# EasyEDA Pro project 降压散热拓展版.eprj

# Schematic Schematic1
Board Name: Board1; Create Date: 2025-02-11; Page Name: P1; Project Name: 降压散热拓展版; Schematic Name: Schematic1; Update Date: 2025-02-11; Company: 嘉立创EDA; Page Size: A4; Version: V1.0
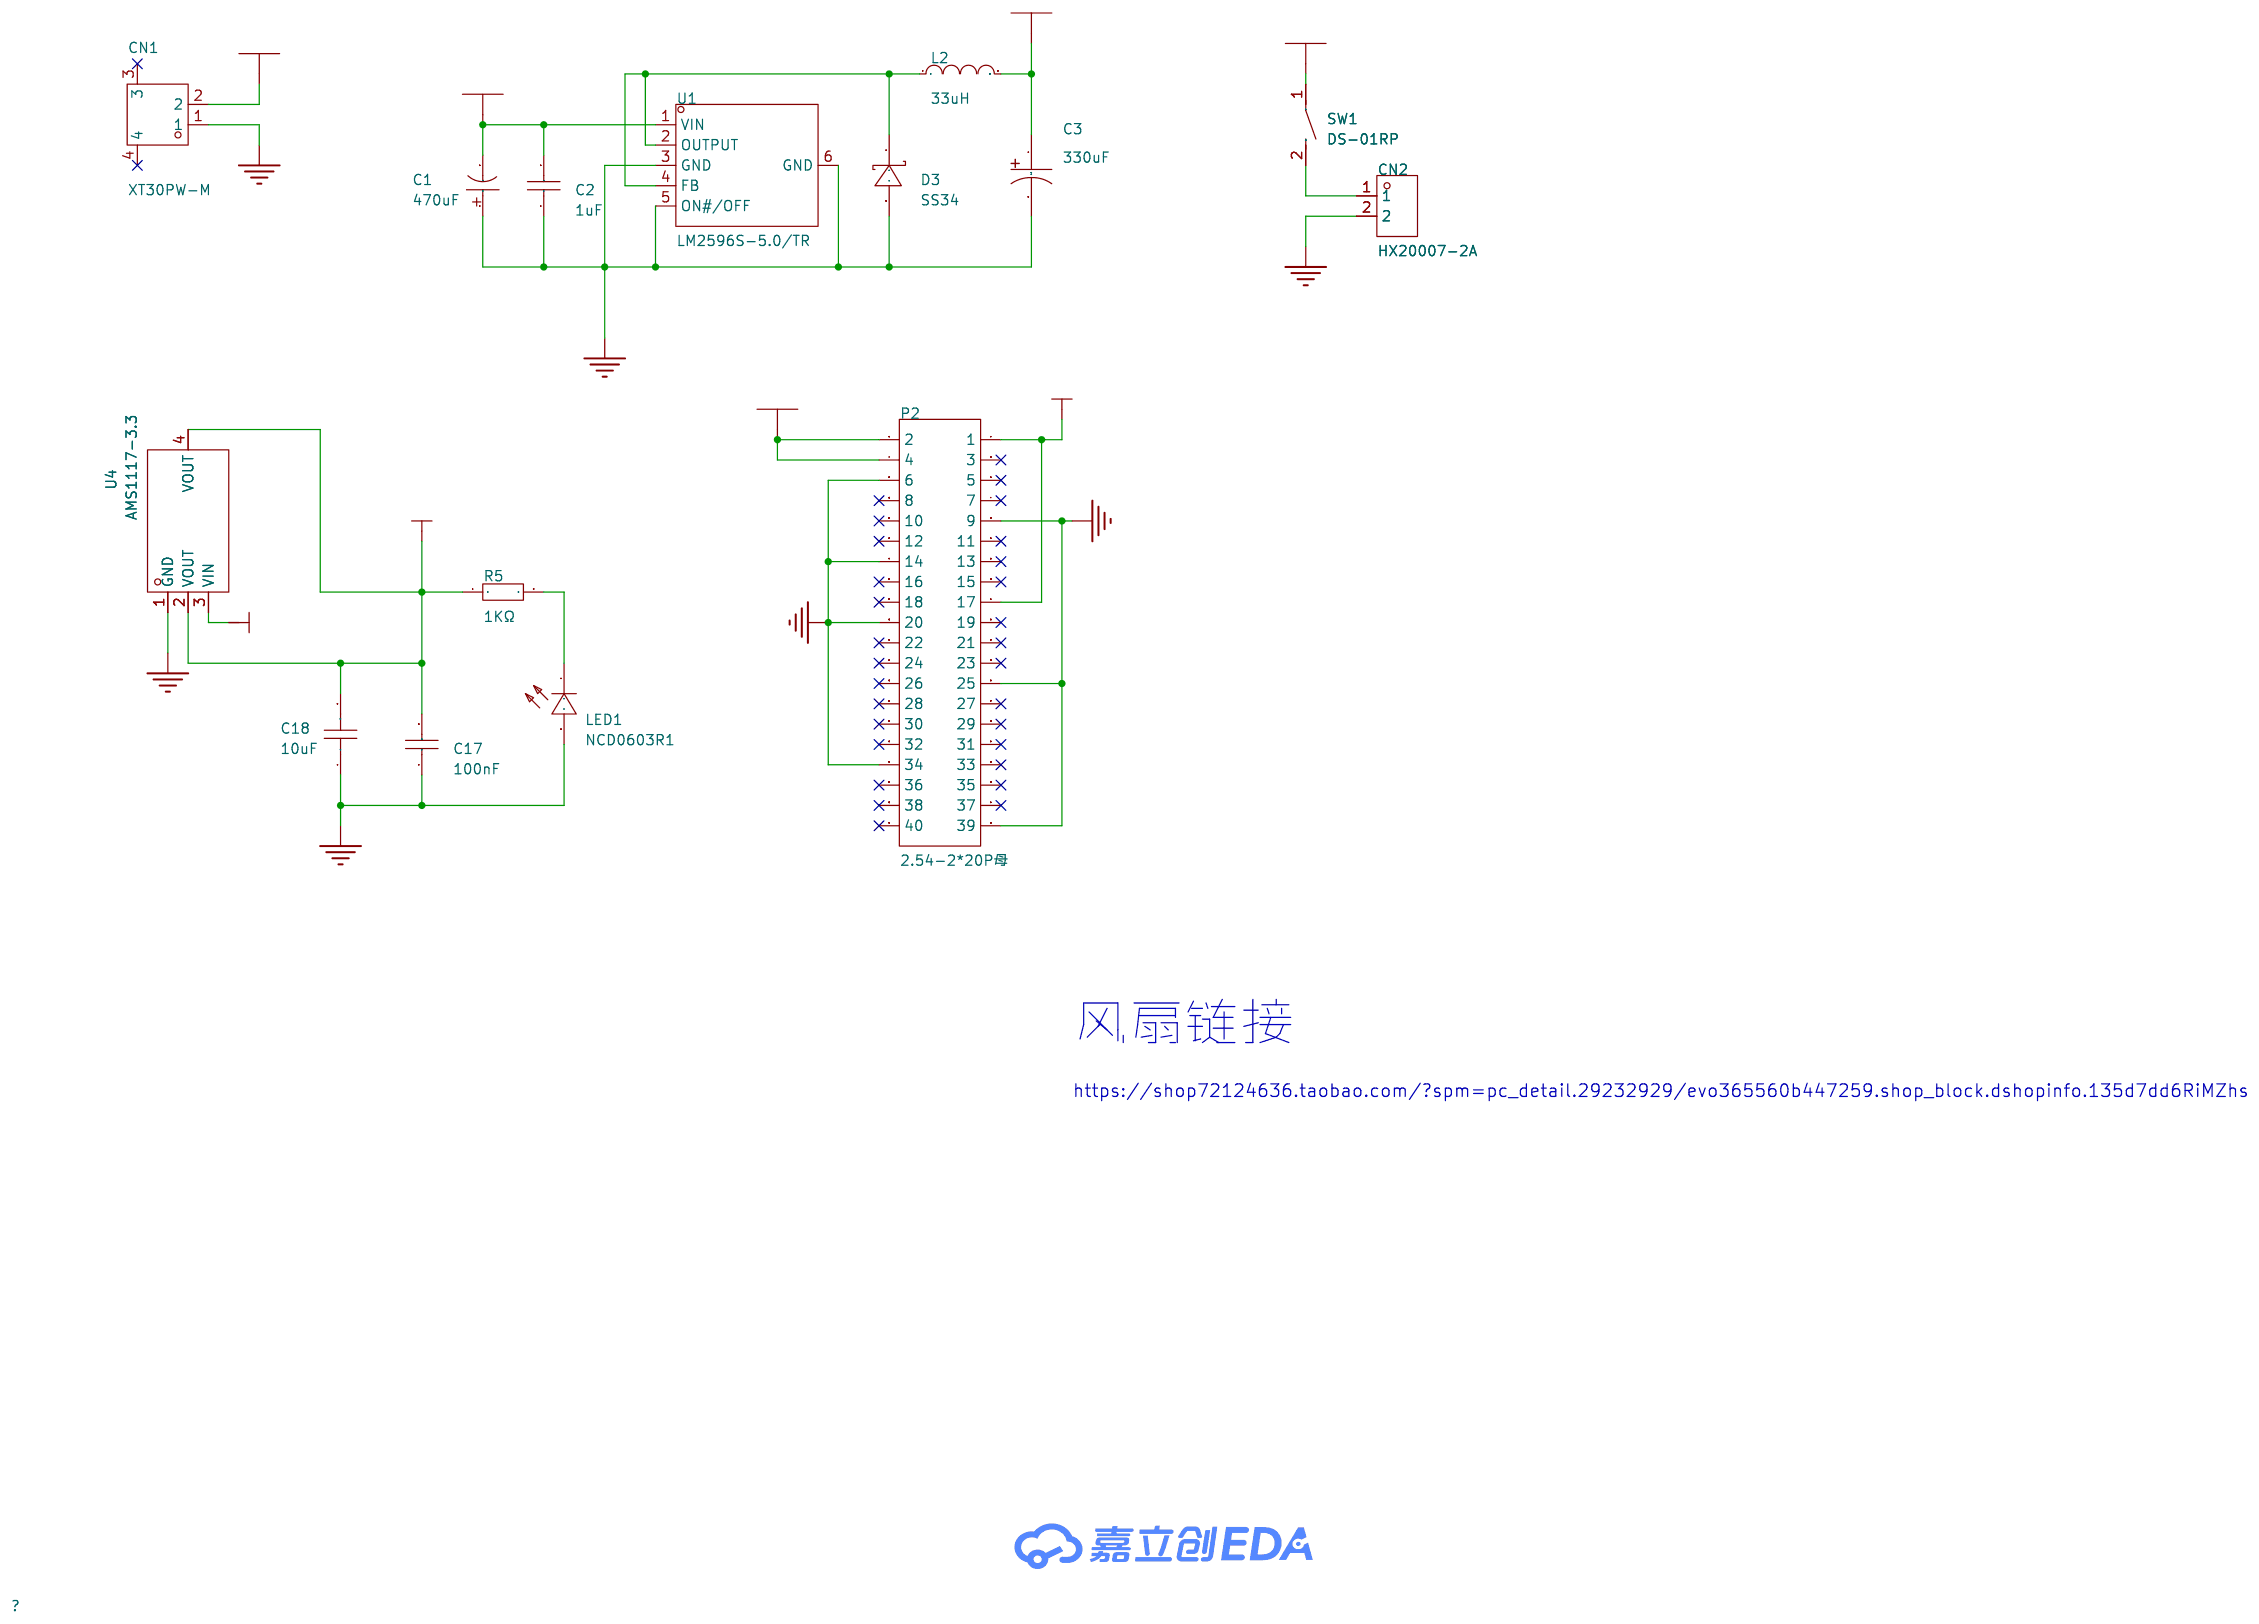
[diagram p0: schematic sheet]

## Parts
C1  470uF  [CAP-TH_BD10.0-P5.00-D1.0-FD]
C2  1uF  [C1206]
C3  330uF  [CAP-TH_BD10.0-P5.00-D1.0-FD]
C17  100nF  [C0603]
C18  10uF  [C0805]
CN1  XT30PW-M  [CONN-TH_XT30PW-M]
CN2  HX20007-2A  [CONN-TH_P2.00_HX20007-2A]
D3  SS34  [DO-214AC_L4.3-W2.7-LS5.3-RD]
L2  33uH  [IND-SMD_L12.0-W12.0]
LED1  NCD0603R1  [LED0603-RD_RED]
P2  2.54-2*20P母  [HDR-TH_40P-P2.54-V-F-R2-C20-S2.54]
R5  1KΩ  [R0603]
SW1  DS-01RP  [SW-TH_DS-01RP]
U1  LM2596S-5.0/TR  [TO-263-5_L10.2-W8.6-P1.70-LS14.4-TL]
U4  AMS1117-3.3  [SOT-223-3_L6.5-W3.4-P2.30-LS7.0-BR]

## Library data of the parts
C1 = KM477M035G17RR0VH2FP0: 精度:±20%;额定电压:35V;电容体长度:17mm;工作温度:-;电容体直径:10mm;容值:470uF;工作寿命:2000hrs 105℃;脚间距:5mm;; LCSC Part Name: 470uF 35V; Supplier Part: C2064; Manufacturer: CX(承兴); Supplier Footprint: 径向引线,10x17mm; JLCPCB Part Class: Extended Part; Datasheet: https://atta.szlcsc.com/upload/public/pdf/source/20151029/1457707511306.pdf; Supplier: LCSC; Tolerance: ±20%; Rated Voltage: 35V; L: 17mm; φD: 10mm; Lifetime @ Temp: 2000hrs 105℃; Lead Spacing: 5mm
C2 = 1206F105M500NT: 容值:1uF;精度:±20%;额定电压:50V;材质(温度系数):Y5V;; LCSC Part Name: 1uF ±20% 50V; Supplier Part: C1926; Manufacturer: FH(风华); Supplier Footprint: 1206; JLCPCB Part Class: Extended Part; Datasheet: https://atta.szlcsc.com/upload/public/pdf/source/20170923/C1926_1506149412165988674.pdf; Supplier: LCSC; Tolerance: ±20%; Voltage Rated: 50V; Temperature Coefficient: Y5V
C3 = 35ZLH330MEFC10X12.5: 容值:330uF;精度:±20%;额定电压:35V;电容体直径:10mm;电容体长度:12.5mm;脚间距:5mm;工作寿命:10000hrs@105℃;; LCSC Part Name: 330uF ±20% 35V; Supplier Part: C75177; Manufacturer: rubycon(红宝石); Supplier Footprint: 径向引线,10x12.5mm; JLCPCB Part Class: Extended Part; Datasheet: https://atta.szlcsc.com/upload/public/pdf/source/20181120/C75177_9BA864076862DA8B15174CC365378275.pdf; Supplier: LCSC; Tolerance: ±20%; Rated Voltage: 35V; φD: 10mm; L: 12.5mm; Lead Spacing: 5mm; Lifetime @ Temp: 10000hrs@105℃
C17 = 0603B104K500NT: 容值:100nF;精度:±10%;额定电压:50V;材质(温度系数):X7R;; LCSC Part Name: 100nF ±10% 50V; Supplier Part: C30926; Manufacturer: FH(风华); Supplier Footprint: 0603; JLCPCB Part Class: 扩展库; Datasheet: https://atta.szlcsc.com/upload/public/pdf/source/20200305/C486355_26A10D38EF8C2A5C37091D0039909270.pdf; Supplier: LCSC; Tolerance: ±10%; Voltage Rated: 50V; Temperature Coefficient: X7R
C18 = CL21A106KAYNNNE_C15850: 容值:10uF;精度:±10%;额定电压:25V;材质(温度系数):X5R;; LCSC Part Name: 10uF ±10% 25V; Supplier Part: C15850; Manufacturer: SAMSUNG(三星); Manufacturer Part: CL21A106KAYNNNE; Supplier Footprint: 0805; JLCPCB Part Class: 基础库; Datasheet: https://atta.szlcsc.com/upload/public/pdf/source/20160218/1457707763339.pdf; Supplier: LCSC; Tolerance: ±10%; Voltage Rated: 25V; Temperature Coefficient: X5R
CN1 = XT30PW-M: Socket,DCsupply,XT30,male,PIN:2; LCSC Part Name: XT30PW-M公头; Supplier Part: C431092; Manufacturer: AMASS(艾迈斯); Supplier Footprint: Through Hole; JLCPCB Part Class: Extended Part; Datasheet: https://atta.szlcsc.com/upload/public/pdf/source/20220222/6A9F22F7850E25B33E1BE430ADF8560B.pdf; Supplier: LCSC
CN2 = HX20007-2A: 参考系列:PH;间距:2mm;插针结构:1x2P;排数:1;每排PIN数:2;行距:-;公母:公型插针;安装方式:直插;额定电流:-;工作温度范围:-;; LCSC Part Name: 母座 直插/直针 2.0mm 2Pin位 母座; Supplier Part: C442175; Manufacturer: HX(红星); Supplier Footprint: 插件,P=2mm; JLCPCB Part Class: Extended Part; Datasheet: https://atta.szlcsc.com/upload/public/pdf/source/20191028/C442175_26CD1C550ED51B497F24596C1C565C1F.pdf; Supplier: LCSC; Reference Series: PH; Pitch: 2mm; Pins Structure: 1x2P; Number of Rows: 1; Number of PINs Per Row: 2; Gender: 公型插针; Mounting Style: 直插
D3 = SS34_C8678: 40V,3A,VF=0.55V 3A; Supplier Part: C8678; Manufacturer: MDD; Supplier Footprint: SMA(DO-214AC); JLCPCB Part Class: Basic Part; Datasheet: https://atta.szlcsc.com/upload/public/pdf/source/20220408/D0396E57A6E83C6AFC0ED25EC9EDE030.pdf; Supplier: LCSC
L2 = SLH1204S330MTT: 精度:±20%;额定电流:2.7A;电感值:33uH;直流电阻(DCR):97mΩ;; LCSC Part Name: 33uH ±20% 2.7A; Supplier Part: C397804; Manufacturer: Sunltech(韩国顺磁); Supplier Footprint: SMD; JLCPCB Part Class: Extended Part; Datasheet: https://atta.szlcsc.com/upload/public/pdf/source/20190627/C397804_EE55E3B08DC17B048B3B2839F2041C56.pdf; Supplier: LCSC; Width: 12mm; Length: 12mm; Tolerance: ±20%; Rated Current: 2.7A; DC Resistance (DCR): 97mΩ
LED1 = NCD0603R1_C84263: 灯头类型:-;发光颜色:红色;正向电压(VF):1.6V~2.6V;功率:65mW;正向电流:20mA;主波长:615nm~630nm;二极管配置:独立二极管;透镜颜色:无色透明透镜;色温:-;发光强度:80mcd~220mcd;发光角度:130°;载带方式:-;工作温度:-30℃~+85℃;; Supplier Part: C84263; Manufacturer: 国星光电; Supplier Footprint: 0603; JLCPCB Part Class: 扩展库; Datasheet: https://atta.szlcsc.com/upload/public/pdf/source/20200820/C84263_DABC6A75E58F576973B407FDBA283D60.pdf; Supplier: LCSC; Emitted Color: 红色; Forward Voltage (VF): 1.6V~2.6V; Power Dissipation: 65mW; Forward Current: 20mA; Dominant Wavelength: 615nm~630nm; Diode Configuration: 独立二极管; Lens Color: 无色透明透镜; Luminous Intensity: 80mcd~220mcd; Viewing Angle: 130°; Operating Temperature: -30℃~+85℃
P2 = 2.54-2*20P母: 间距:2.54mm;总孔位数:40;排数:2;插孔结构:2x20P;行距:2.54mm;安装类型:直插;塑高:-;触头材质:黄铜;触头镀层:-;; LCSC Part Name: 2.54mm 2x20P; Supplier Part: C50982; Manufacturer: BOOMELE(博穆精密); Supplier Footprint: 直插,P=2.54mm; JLCPCB Part Class: Extended Part; Datasheet: https://atta.szlcsc.com/upload/public/pdf/source/20151109/1457707571530.pdf; Supplier: LCSC; Pitch: 2.54mm; Number of Holes: 40; Number of Rows: 2; Holes Structure: 2x20P; Row Spacing: 2.54mm; Mounting Type: 直插; Contact Material: 黄铜
R5 = RC0603FR-07470RL: 电阻类型:厚膜电阻;阻值:470Ω;精度:±1%;功率:100mW;最大工作电压:75V;温度系数:±100ppm/℃;; LCSC Part Name: 厚膜电阻 470Ω ±1% 100mW; Supplier Part: C114669; Manufacturer: YAGEO(国巨); Supplier Footprint: 0603; JLCPCB Part Class: 扩展库; Datasheet: https://atta.szlcsc.com/upload/public/pdf/source/20180821/C275644_0D56F95EFF785E7D9A1FEF436B37DA78.pdf; Supplier: LCSC; Type: 厚膜电阻; Tolerance: ±1%; Power(Watts): 100mW; Overload Voltage (Max): 75V; Temperature Coefficient: ±100ppm/℃; Operating Temperature Range: -55℃~+155℃
SW1 = DS-01RP: 类型:平拨，凸起式;额定电流:25mA;额定电压:24V;电路结构:单刀单掷;开关位数:1;引脚间距:-;工作温度:-20℃~+70℃;使用寿命:3000;颜色:红色;; LCSC Part Name: 红色1PIN立式直插正拨拨码开关; Supplier Part: C129059; Manufacturer: 韩国韩荣; Supplier Footprint: 插件; JLCPCB Part Class: Extended Part; Datasheet: https://atta.szlcsc.com/upload/public/pdf/source/20191118/C129059_51F1ED47ECA198F739F369D83343E373.pdf; Supplier: LCSC; Type: 平拨，凸起式; Current Rating: 25mA; Voltage Rating: 24V; Circuit: 单刀单掷; Number of Positions: 1; Operating Temperature: -20℃~+70℃; Operating Life: 3000; Color: 红色
U1 = LM2596S-5.0/TR: Supplier Part: C194349; Manufacturer: HGSEMI(华冠); Supplier Footprint: TO-263-5; JLCPCB Part Class: Extended Part; Datasheet: https://atta.szlcsc.com/upload/public/pdf/source/20200924/C194349_32A49216D05BD4A6AA6EE8DE19C810A9.pdf; Supplier: LCSC
U4 = AMS1117-3.3_C6186: 输出类型:固定;最大输入电压:-;输出电压:3.3V;最大输出电流:1A;电源纹波抑制比(PSRR):72dB@(120Hz);输出极性:正极;; LCSC Part Name: 输出3.3V 1A; Supplier Part: C6186; Manufacturer: AMS; Supplier Footprint: SOT-223; JLCPCB Part Class: 基础库; Datasheet: https://atta.szlcsc.com/upload/public/pdf/source/20180727/C6186_7A095716F0823C02F1997A905E26C086.pdf; Supplier: LCSC; Output Type: 固定; Output Voltage: 3.3V; MAX Output Current: 1A; Power Supply Rejection Ratio (PSRR): 72dB@(120Hz); Dropout Voltage: 1.3V@(800mA); Output Polarity: 正极; Number of Outputs: 1

## Nets
GND: C1.1 C2.1 C3.2 C17.1 C18.1 CN1.1 CN2.2 D3.2(A) LED1.2(A) P2.6 P2.9 P2.14 P2.20 P2.25 P2.34 P2.39 U1.3(GND) U1.5(ON#/OFF) U1.6(GND) U4.1(GND)
VIN: C1.2 C2.2 CN1.2 U1.1(VIN)
VOUT_3V3: C17.2 C18.2 P2.1 P2.17 R5.1 U4.2(VOUT) U4.4(VOUT)
VOUT_5V: C3.1 L2.2 P2.2 P2.4 SW1.1 U4.3(VIN)
$1N2541: LED1.1(K) R5.2
$1N2644: CN2.1 SW1.2
$1N3055: D3.1(K) L2.1 U1.2(OUTPUT) U1.4(FB)

Not connected (* = marked no-connect by the designer): CN1 3* 4*; P2 3* 5* 7* 8* 10* 11* 12* 13* 15* 16* 18* 19* 21* 22* 23* 24* 26* 27* 28* 29* 30* 31* 32* 33* 35* 36* 37* 38* 40*

## Notes on the sheet
- 风扇链接
- https://shop72124636.taobao.com/?spm=pc_detail.29232929/evo365560b447259.shop_block.dshopinfo.135d7dd6RiMZhs

# Board PCB1
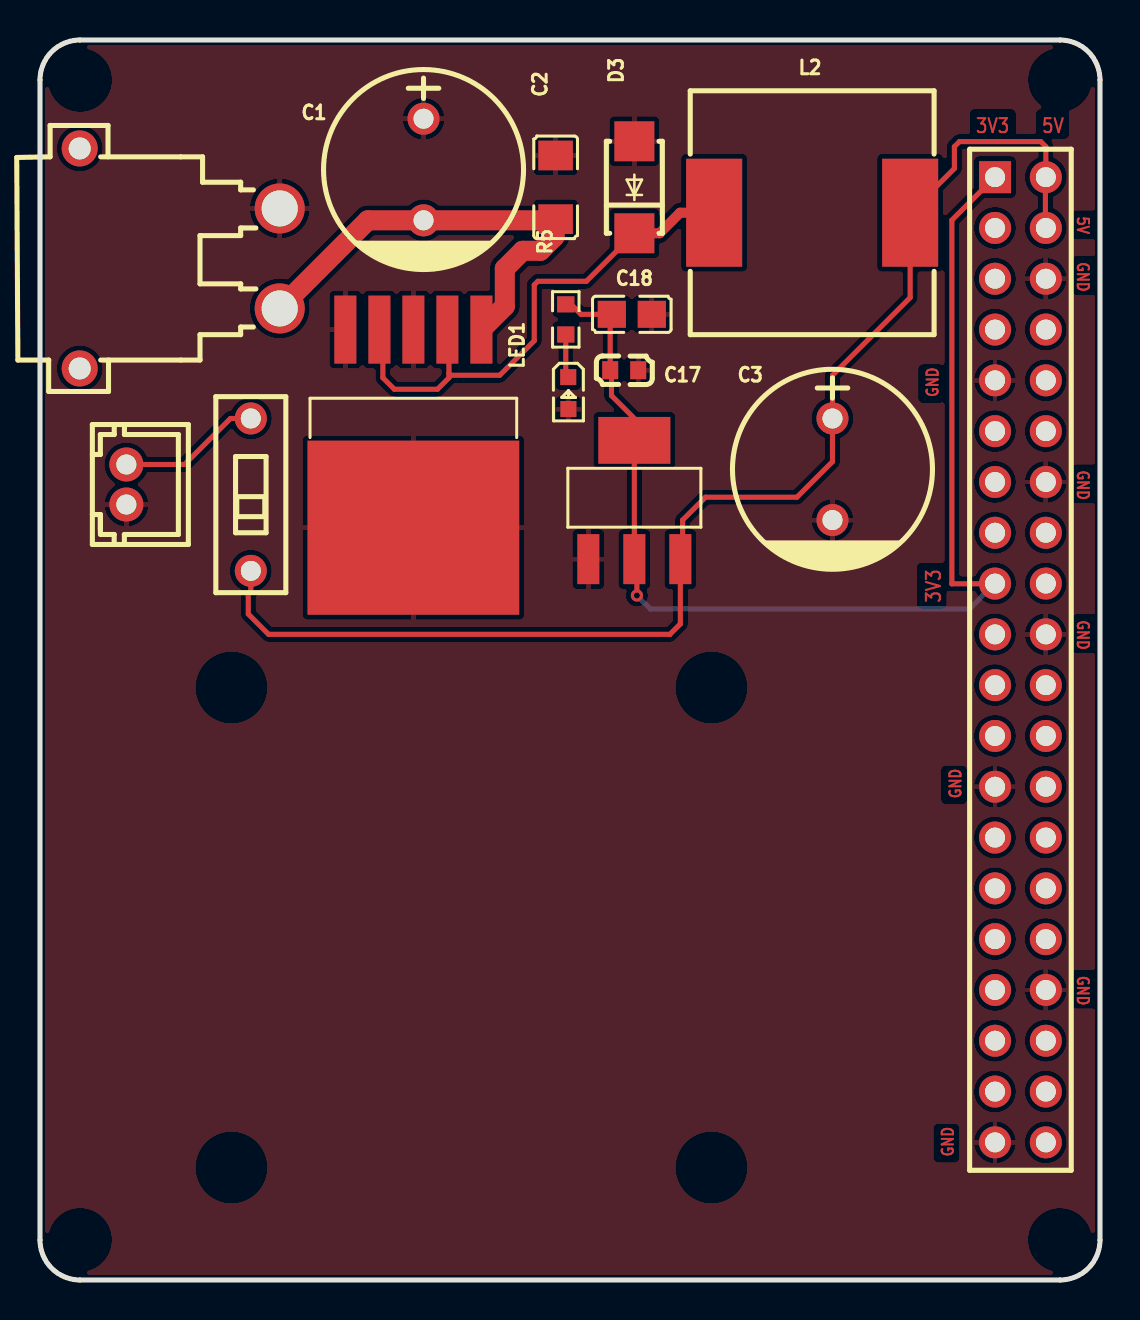
[diagram p1: board, top side]
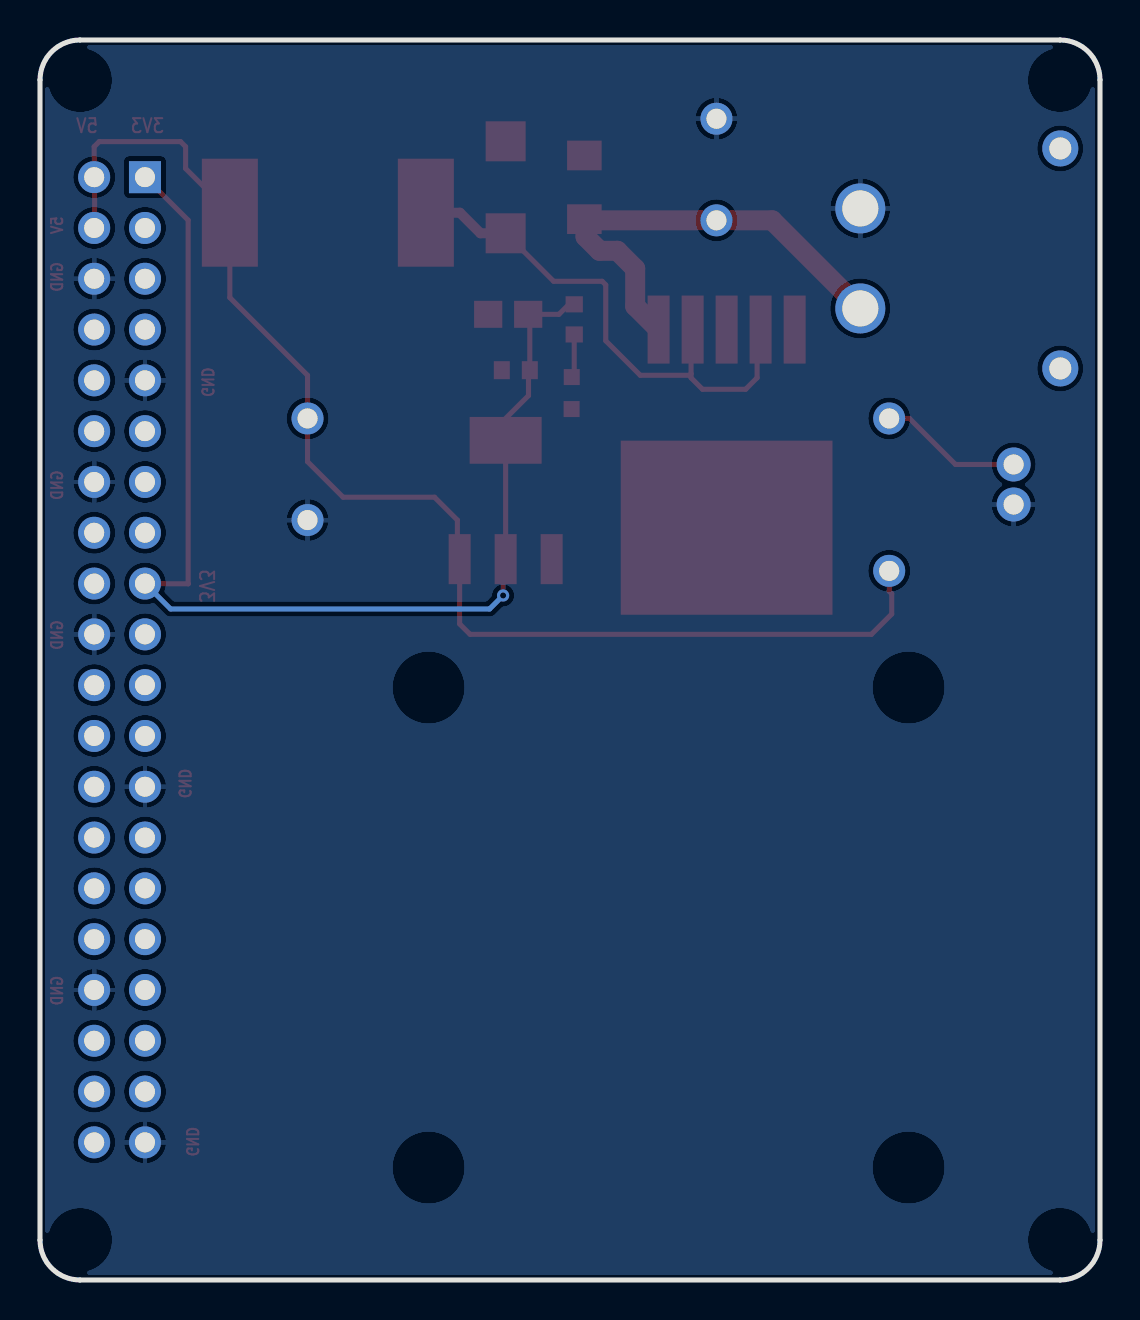
[diagram p2: board, bottom side, seen from below]

Outline 53 x 62 mm; copper layers: Top Layer, Bottom Layer. Coordinates in mm from the lower left corner of the outline.
Outline path: 0,60 0,2 arc(0.59,0.59) 2,0 51,0 arc(52.41,0.59) 53,2 53,60 arc(52.41,61.41) 51,62 2,62 arc(0.59,61.41) 0,60
Stack: Top Layer 0.035mm / Dielectric1 1.51mm FR4 er 4.5 / Bottom Layer 0.035mm

## Design rules (mm)
template: JLCPCB Capability(Two Layers Board)
spacing copperThickness1oz (default): track to track 0.102, other pairs 0.152 to 0.3
spacing copperThickness2oz: track to track 0.203, other pairs 0.152 to 0.3
track width copperThickness1oz (default): min 0.127, default 0.254, max 2.54
track width copperThickness2oz: min 0.203, default 0.254, max 2.54
differential pair differentialPair (default): width min 0.127, default 0.254, max 2.54; gap min 0.152, default 0.152
via viaSize (default): diameter min 0.5, default 0.61, max 10; hole min 0.3, default 0.305, max 6.3

## Placement (name value [footprint] x y rotation side)
C1  470uF  [CAP-TH_BD10.0-P5.00-D1.0-FD]  19.18 55.52 270 top
C2  1uF  [C1206]  25.78 54.63 270 top
C3  330uF  [CAP-TH_BD10.0-P5.00-D1.0-FD]  39.62 40.54 270 top
C17  100nF  [C0603]  29.21 45.49 180 top
C18  10uF  [C0805]  29.59 48.28 180 top
CN1  XT30PW-M  [CONN-TH_XT30PW-M]  6.98 51.08 270 top
CN2  HX20007-2A  [CONN-TH_P2.00_HX20007-2A]  4.32 39.78 90 top
D3  SS34  [DO-214AC_L4.3-W2.7-LS5.3-RD]  29.72 54.63 90 top
L2  33uH  [IND-SMD_L12.0-W12.0]  38.61 53.36 180 top
LED1  NCD0603R1  [LED0603-RD_RED]  26.42 44.35 270 top
P2  2.54-2*20P母  [HDR-TH_40P-P2.54-V-F-R2-C20-S2.54]  49.02 31.01 270 top
R5  1KΩ  [R0603]  26.29 48.03 270 top
SW1  DS-01RP  [SW-TH_DS-01RP]  10.54 39.27 0 top
U1  LM2596S-5.0/TR  [TO-263-5_L10.2-W8.6-P1.70-LS14.4-TL]  18.67 42.57 270 top
U4  AMS1117-3.3  [SOT-223-3_L6.5-W3.4-P2.30-LS7.0-BR]  29.72 39.01 270 top

## Footprints (pads in the part's own frame, mm; a bottom-side part is the same pattern mirrored in y, then rotated)
C0603
  rect 0.8x0.9 smd: 1(-0.7,0) 2(0.7,0)
C0805
  rect 1.41x1.35 smd: 1(-1,0) 2(1,0)
C1206
  rect 1.485x1.728 smd: 1(-1.593,0) 2(1.593,0)
CAP-TH_BD10.0-P5.00-D1.0-FD
  round 1.6 hole 1: 1(-2.54,0) 2(2.54,0)
CONN-TH_P2.00_HX20007-2A
  round 1.7 hole 1.001: 1(1.001,0) 2(-1.001,0)
CONN-TH_XT30PW-M
  round 2.5 hole 1.8: 1(-2.5,5) 2(2.5,5)
  round 1.8 hole 1.1: 3(5.5,-5) 4(-5.5,-5)
DO-214AC_L4.3-W2.7-LS5.3-RD
  rect 1.999x1.999 smd: 1(-2.299,0) 2(2.301,0)
HDR-TH_40P-P2.54-V-F-R2-C20-S2.54
  rect 1.6x1.6 hole 1: 1(-24.13,-1.27)
  round 1.6 hole 1: 2(-24.13,1.27) 3(-21.59,-1.27) 4(-21.59,1.27) 5(-19.05,-1.27) 6(-19.05,1.27) 7(-16.51,-1.27) 8(-16.51,1.27) 9(-13.97,-1.27) 10(-13.97,1.27) 11(-11.43,-1.27) 12(-11.43,1.27) 13(-8.89,-1.27) 14(-8.89,1.27) 15(-6.35,-1.27) 16(-6.35,1.27) 17(-3.81,-1.27) 18(-3.81,1.27) 19(-1.27,-1.27) 20(-1.27,1.27) 21(1.27,-1.27) 22(1.27,1.27) 23(3.81,-1.27) 24(3.81,1.27) 25(6.35,-1.27) 26(6.35,1.27) 27(8.89,-1.27) 28(8.89,1.27) 29(11.43,-1.27) 30(11.43,1.27) 31(13.97,-1.27) 32(13.97,1.27) 33(16.51,-1.27) 34(16.51,1.27) 35(19.05,-1.27) 36(19.05,1.27) 37(21.59,-1.27) 38(21.59,1.27) 39(24.13,-1.27) 40(24.13,1.27)
IND-SMD_L12.0-W12.0
  rect 2.8x5.4 smd: 1(4.9,0) 2(-4.9,0)
LED0603-RD_RED
  rect 0.8x0.8 smd: 1(-0.799,-0.004) 2(0.799,0.004)
R0603
  rect 0.806x0.864 smd: 1(-0.753,0) 2(0.753,0)
SOT-223-3_L6.5-W3.4-P2.30-LS7.0-BR
  rect 2.5x1.1 smd: 1(2.97,-2.3) 2(2.97,0) 3(2.97,2.3)
  rect 2.34x3.6 smd: 4(-2.97,0)
SW-TH_DS-01RP
  round 1.6 hole 1.001: 1(0,-3.81) 2(0,3.81)
TO-263-5_L10.2-W8.6-P1.70-LS14.4-TL
  rect 3.401x1.1 smd: 1(-4.953,3.401) 2(-4.953,1.7) 3(-4.953,0) 4(-4.953,-1.7) 5(-4.953,-3.401)
  rect 8.704x10.586 smd: 6(4.953,0)

## Nets
As in the schematic.

Pads without a net: CN1 3 4; P2 3 5 7 8 10 11 12 13 15 16 18 19 21 22 23 24 26 27 28 29 30 31 32 33 35 36 37 38 40

## Via types
v1: diameter 0.61, hole 0.305, Top Layer to Bottom Layer, 1 via

## Routing (per net, layer and track width the routed paths; a pad name or vN(x,y) marks a point on that pad's centre or on a via; arc(x,y) is an arc through that point)
VIN: length 23.1
  Top Layer w1: 25.72,52.98 C2.2 ; 25.72,52.98 16.39,52.98 CN1.2 ; 25.72,52.98 25.72,52.16 25.02,51.46 24.13,51.46 23.24,50.57 23.24,48.69 U1.1
VOUT_3V3: length 58.1
  Top Layer w0.254: R5.1 26.55,48.78 27.05,48.28 C18.2 28.51,48.2 C17.2 28.57,45.42 28.57,44.22 29.72,43.08 ; 47.73,34.81 45.59,34.81 45.59,34.82 45.59,52.99 47.73,55.13 ; v1(29.84,34.23) 29.84,35.92 U4.2 U4.4
  Bottom Layer w0.254: 47.73,34.81 46.47,33.55 30.52,33.55 v1(29.84,34.23)
VOUT_5V: length 65.8
  Top Layer w0.254: 32.02,35.79 32.02,32.8 31.5,32.28 11.43,32.28 10.41,33.3 10.41,34.31 10.54,34.44 SW1.1 ; 32.02,35.79 U4.3 ; 32.02,35.79 32.13,35.9 32.13,38 33.27,39.14 37.85,39.14 39.62,40.92 39.62,45.24 43.51,49.12 L2.2 45.72,55.58 45.72,56.67 45.97,56.92 50.04,56.92 50.29,56.67 50.29,55.15 50.27,55.13 50.27,52.59
$1N2541: length 2.2
  Top Layer w0.254: R5.2 26.29,45.27 LED1.1
$1N2644: length 7.2
  Top Layer w0.254: CN2.1 7.22,40.78 9.53,43.08 SW1.2
$1N3055: length 27
  Top Layer w0.254: U1.4 17.15,47.35 17.15,45.11 17.72,44.54 19.88,44.54 20.45,45.11 20.45,45.31 ; 20.45,45.31 20.45,47.44 U1.2 ; 20.45,45.31 20.52,45.24 22.99,45.24 24.71,46.96 24.71,49.76 24.89,49.94 27.32,49.94 D3.1
  Top Layer w0.5: L2.1 32,53.36 30.98,52.34 D3.1

## Copper pours and planes (outline as drawn; the poured copper is in the pictures)
GND on Top Layer: -10.67,66.83 64.26,66.83 64.26,-5.18 -10.67,-5.18
GND on Top Layer: -8.64,63.65 59.94,63.65 59.94,-2.26 -8.64,-2.26
GND on Top Layer: -5.08,66.06 59.69,66.06 59.69,-1.25 -5.08,-1.25
GND on Top Layer: -6.48,69.24 61.47,69.24 61.47,-6.83 -6.48,-6.83
GND on Top Layer: -5.72,64.29 61.98,64.29 61.98,-2.9 -5.72,-2.9
GND on Top Layer: -8.13,66.7 58.17,66.7 58.17,-3.91 -8.13,-3.91
GND on Top Layer: -3.17,64.16 57.02,64.16 57.02,-4.68 -3.17,-4.68
GND on Bottom Layer: -3.68,66.06 59.31,66.06 59.31,-1.63 -3.68,-1.63
GND on Bottom Layer: -7.11,69.37 63.12,69.37 63.12,-8.99 -7.11,-8.99
GND on Bottom Layer: -5.97,67.97 63.88,67.97 63.88,-9.75 -5.97,-9.75
GND on Bottom Layer: -3.81,64.29 60.2,64.29 60.2,-2.77 -3.81,-2.77
GND on Bottom Layer: -1.91,63.52 56.01,63.52 56.01,-2.39 -1.91,-2.39

## Text on the board
Top Layer: GND | 5V | 3V3
